# EAGLE design d700 decoder (EAGLE 9.6.2)
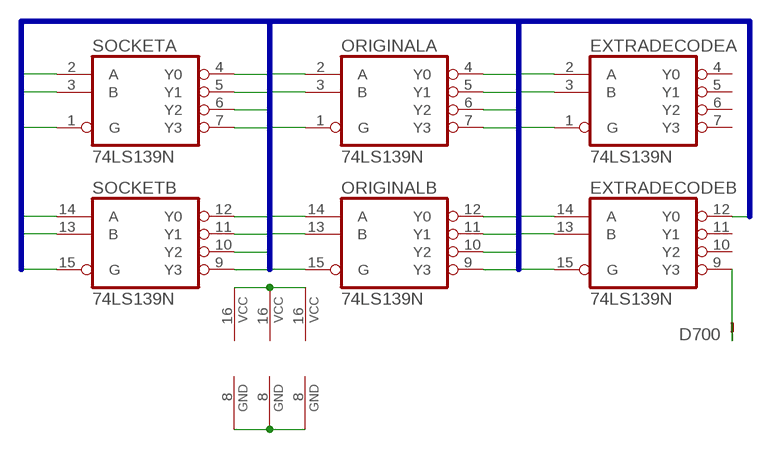
[diagram p0: schematic, sheet 1]

## Parts
D700  TP  [JP1]
EXTRADECODE  74LS139N  [DIL16]
ORIGINAL  74LS139N  [DIL16]
SOCKET  74LS139N  [DIL16]

## Nets
A(2): EXTRADECODE.2(A:A) ORIGINAL.2(A:A) SOCKET.2(A:A)
A(14): EXTRADECODE.14(B:A) ORIGINAL.14(B:A) SOCKET.14(B:A)
B(3): EXTRADECODE.3(A:B) ORIGINAL.3(A:B) SOCKET.3(A:B)
B(13): EXTRADECODE.13(B:B) ORIGINAL.13(B:B) SOCKET.13(B:B)
G(1): EXTRADECODE.1(A:G) ORIGINAL.1(A:G) SOCKET.1(A:G)
G(15): ORIGINAL.15(B:G) SOCKET.15(B:G)
GND: EXTRADECODE.8(P:GND) ORIGINAL.8(P:GND) SOCKET.8(P:GND)
N$2: D700.1 EXTRADECODE.9(B:Y3)
SIDINTERNAL: EXTRADECODE.15(B:G) ORIGINAL.5(A:Y1)
VCC: EXTRADECODE.16(P:VCC) ORIGINAL.16(P:VCC) SOCKET.16(P:VCC)
Y0(4-VICOUT): ORIGINAL.4(A:Y0) SOCKET.4(A:Y0)
Y0(12): ORIGINAL.12(B:Y0) SOCKET.12(B:Y0)
Y1(5-SIDOUT): EXTRADECODE.12(B:Y0) SOCKET.5(A:Y1)
Y1(11): ORIGINAL.11(B:Y1) SOCKET.11(B:Y1)
Y2(6): ORIGINAL.6(A:Y2) SOCKET.6(A:Y2)
Y2(10): ORIGINAL.10(B:Y2) SOCKET.10(B:Y2)
Y3(7): ORIGINAL.7(A:Y3) SOCKET.7(A:Y3)
Y3(9): ORIGINAL.9(B:Y3) SOCKET.9(B:Y3)
Unconnected: EXTRADECODE.4(A:Y0) EXTRADECODE.5(A:Y1) EXTRADECODE.6(A:Y2) EXTRADECODE.7(A:Y3) EXTRADECODE.10(B:Y2) EXTRADECODE.11(B:Y1)

## Buses
A(2),A(14),B(3),B(13),G(1),G(15),GND,SIDINTERNAL,VCC,VICINTERNAL,Y0(4-VICOUT),Y0(12),Y1(5-SIDOUT),Y1(11),Y2(6),Y2(10),Y3(7),Y3(9)

## Library data of the parts
D700 = 0RB_Connectors:TP
EXTRADECODE ORIGINAL SOCKET = 74xx-us:74*139: Dual 2-line to 4-line DECODER/DEMULTIPLEXER

## Board
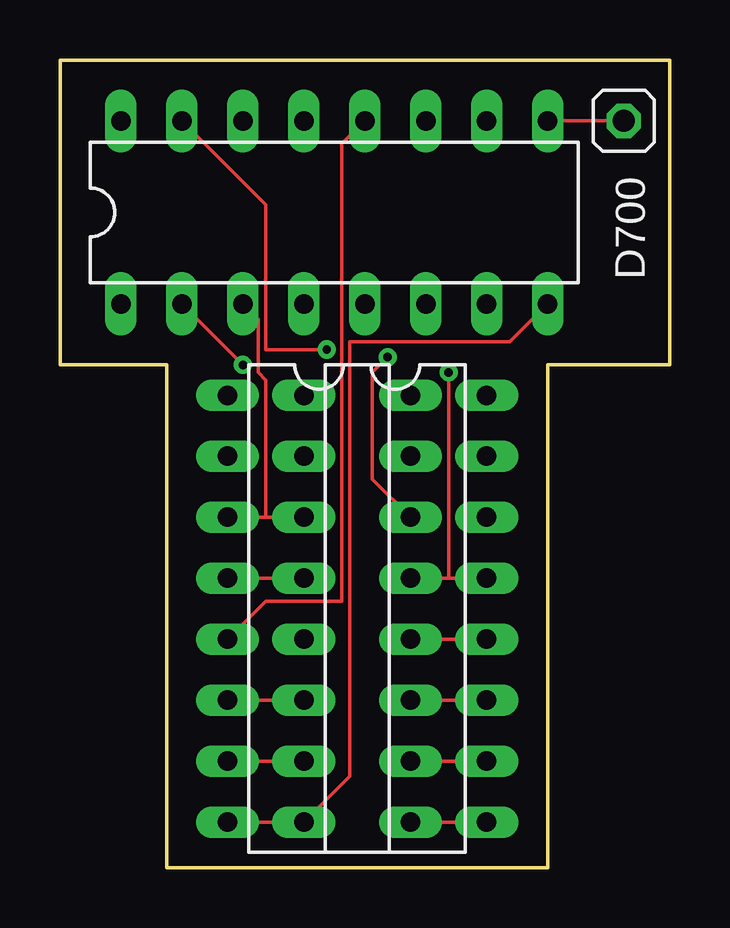
[diagram p1: board, top side]
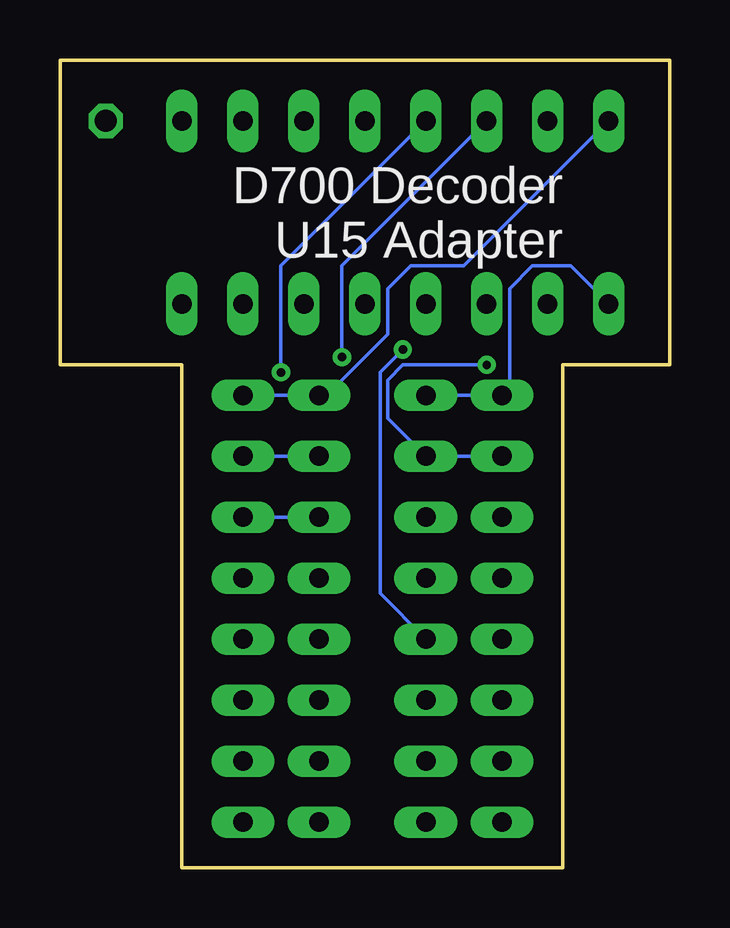
[diagram p2: board, bottom side, seen from below]

Size 25.4 x 33.66 mm. Coordinates in mm from the lower left corner, seen from the top.
Outline: 0,33.66 0,20.95 4.45,20.95 4.45,0 20.32,0 20.32,20.95 25.4,20.95 25.4,33.66 0,33.66
Copper layers (1*16): Top 0.035mm / dielectric 1.5mm / Bottom 0.035mm
Design rules "default": minimum track width 6mil, minimum drill 0.35mm, track to track 6mil, track to pad 6mil, pad to pad 6mil, via to via 6mil, smd to smd 6mil, copper to edge 40mil, drill to drill 6mil, minimum pad ring 10mil, minimum via ring 8mil, stop-mask expansion 4mil, vias tented up to drill 0mil, thermal gap 10mil

### Footprints (pad centres in the part's own frame; a part is rotated, then mirrored left to right if it is on the bottom)
JP1 = drill 0.914 octagon: 1 0,0
DIL16 = drill 0.813 long: 1 -8.89,-3.81; 2 -6.35,-3.81; 3 -3.81,-3.81; 4 -1.27,-3.81; 5 1.27,-3.81; 6 3.81,-3.81; 7 6.35,-3.81; 8 8.89,-3.81; 9 8.89,3.81; 10 6.35,3.81; 11 3.81,3.81; 12 1.27,3.81; 13 -1.27,3.81; 14 -3.81,3.81; 15 -6.35,3.81; 16 -8.89,3.81

### Placement (x,y rotation side)
D700  23.5,31.11 0 top
EXTRADECODE  11.43,27.3 0 top
ORIGINAL  13.97,10.79 270 top
SOCKET  10.79,10.79 270 top

### Tracks (layer width: path | path; a pad name or v marks a point on that pad's centre or on a via)
A(2)  (via drill 0.35)
  Top 0.152: v7.62,20.95 EXTRADECODE.2
  Bottom 0.152: SOCKET.2 ORIGINAL.2 11.75,18.73 11.75,20.32 11.11,20.95 v7.62,20.95
A(14)  (via drill 0.35)
  Top 0.152: v13.65,21.27 13.02,20.64 13.02,16.19 SOCKET.14
  Bottom 0.152: ORIGINAL.14 SOCKET.14 | EXTRADECODE.14 13.65,25.08 v13.65,21.27
B(3)
  Top 0.152: ORIGINAL.3 8.57,14.61 | 8.57,14.61 SOCKET.3 | EXTRADECODE.3 8.26,22.86 8.26,20.64 8.57,20.32 8.57,14.61
B(13)  (via drill 0.35)
  Top 0.152: ORIGINAL.13 16.19,12.06 | 16.19,12.06 SOCKET.13 | 16.19,12.06 v16.19,20.64
  Bottom 0.152: EXTRADECODE.13 16.19,25.08 v16.19,20.64
G(1)
  Bottom 0.152: ORIGINAL.1 SOCKET.1 6.67,20 6.67,24.13 5.71,25.08 4.13,25.08 EXTRADECODE.1
G(15)
  Bottom 0.152: ORIGINAL.15 SOCKET.15
GND
  Top 0.152: SOCKET.8 ORIGINAL.8 12.06,3.81 12.06,21.91 18.73,21.91 EXTRADECODE.8
N$2
  Top 0.152: D700.1 EXTRADECODE.9
SIDINTERNAL  (via drill 0.35)
  Top 0.152: v11.11,21.59 8.57,21.59 8.57,27.62 EXTRADECODE.15
  Bottom 0.152: ORIGINAL.5 12.06,11.43 12.06,20.64 v11.11,21.59
VCC
  Bottom 0.152: ORIGINAL.16 SOCKET.16 14.29,19.68 11.75,22.23 11.75,24.13 10.79,25.08 8.57,25.08 EXTRADECODE.16
Y0(4-VICOUT)
  Top 0.152: ORIGINAL.4 SOCKET.4
Y0(12)
  Top 0.152: ORIGINAL.12 SOCKET.12
Y1(5-SIDOUT)
  Top 0.152: SOCKET.5 8.57,11.11 11.75,11.11 11.75,30.16 EXTRADECODE.12
Y1(11)
  Top 0.152: ORIGINAL.11 SOCKET.11
Y2(6)
  Top 0.152: ORIGINAL.6 SOCKET.6
Y2(10)
  Top 0.152: ORIGINAL.10 SOCKET.10
Y3(7)
  Top 0.152: ORIGINAL.7 SOCKET.7
Y3(9)
  Top 0.152: ORIGINAL.9 SOCKET.9

### Text on the board
bPlace: D700 Decoder / U15 Adapter